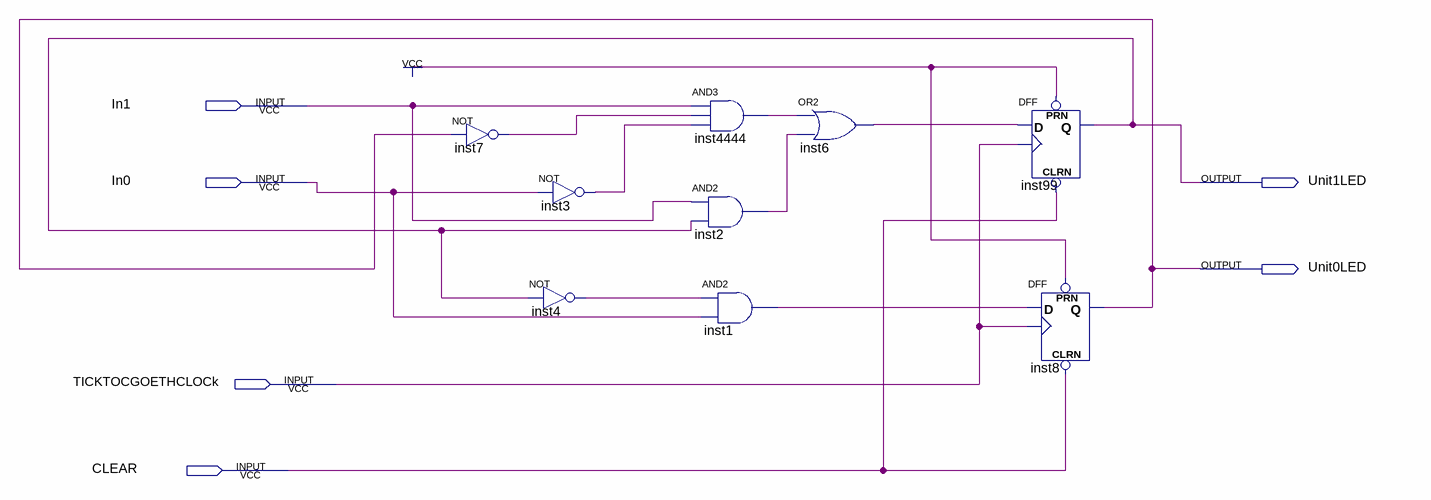
[diagram p0: schematic sheet]
// Quartus schematic Lab4BABY.bdf as structural Verilog: 9 symbols, 6 pins
module Lab4BABY (
  input  In1,
  input  In0,
  input  TICKTOCGOETHCLOCk,
  input  CLEAR,
  output Unit1LED,
  output Unit0LED
);

  wire inst1_out, inst2_out, inst3_out, inst4_out, inst6_out, inst7_out, inst4444_out;

  not inst7 (inst7_out, Unit0LED);
  not inst3 (inst3_out, In0);
  not inst4 (inst4_out, Unit1LED);
  and inst4444 (inst4444_out, In1, inst7_out, inst3_out);
  and inst2 (inst2_out, In1, Unit1LED);
  and inst1 (inst1_out, inst4_out, In0);
  or inst6 (inst6_out, inst4444_out, inst2_out);
  DFF inst99 (.CLRN(CLEAR), .CLK(TICKTOCGOETHCLOCk), .D(inst6_out), .PRN(1'b1), .Q(Unit1LED));
  DFF inst8 (.CLRN(CLEAR), .CLK(TICKTOCGOETHCLOCk), .D(inst1_out), .PRN(1'b1), .Q(Unit0LED));
endmodule
